# Altium schematic sheet ant_pcb.SchDoc
size A4; SheetNumber: 1; SheetTotal: 1
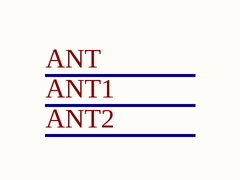
[diagram p0: ant_pcb.SchDoc]